# EAGLE design rgb-matrix-backpack-3-test (EAGLE 6.2)
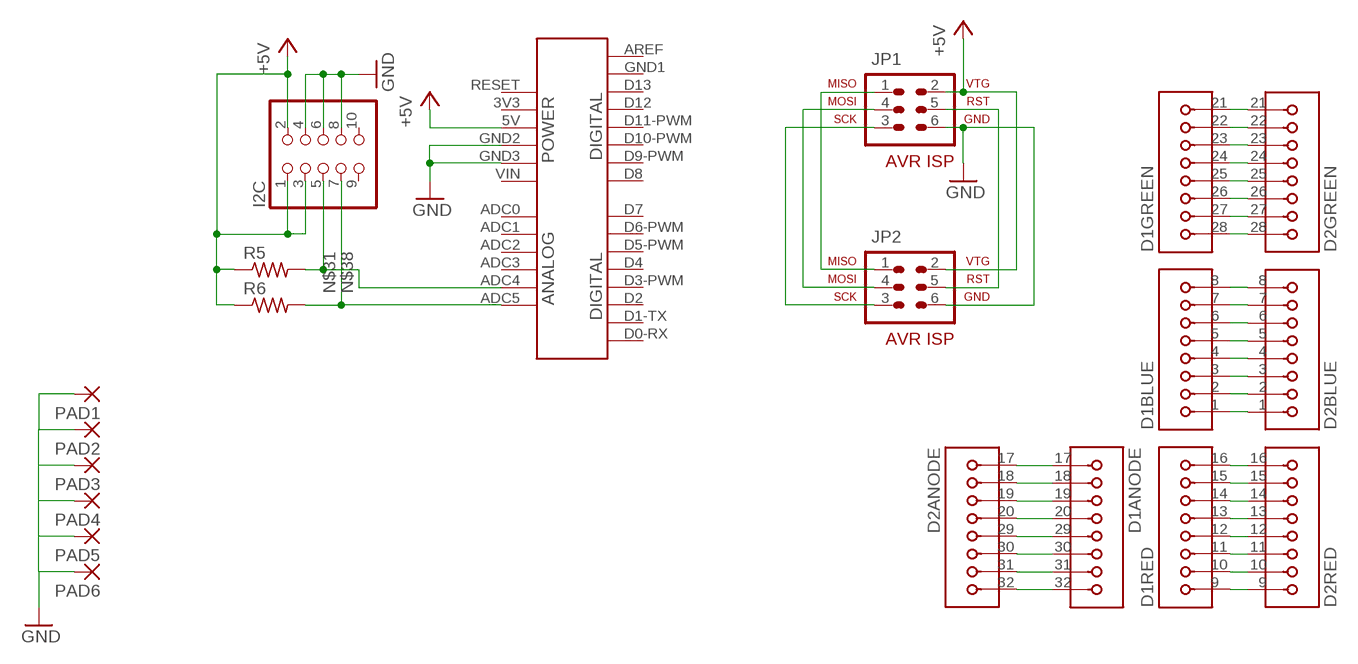
[diagram p0: schematic, sheet 1]

## Parts
D1  60MM-8X8-RGB-LED-ARRAY  [60MM-8X8-RGB-MATRIX]
D2  60MM-8X8-RGB-LED-ARRAY  [60MM-8X8-RGB-MATRIX]
I2C  PINHD-2X5_2.54-90°  [2X05/90]
JP1  AVR-ISP-6  [AVR-ISP-6]
JP2  AVR-ISP-6  [AVR-ISP-6]
PAD1  1,6/0,8  [1,6/0,8]
PAD2  1,6/0,8  [1,6/0,8]
PAD3  1,6/0,8  [1,6/0,8]
PAD4  1,6/0,8  [1,6/0,8]
PAD5  1,6/0,8  [1,6/0,8]
PAD6  1,6/0,8  [1,6/0,8]
R5  R-US_R0603  [R0603]
R6  R-US_R0603  [R0603]
SHIELD1  2009  [2009]

## Nets
+5V [power]: I2C.1 I2C.2 I2C.3 JP1.2 JP2.2 R5.1 R6.1 SHIELD1.5V
GND [power]: I2C.4 I2C.6 I2C.8 JP1.6 JP2.6 PAD1.1(P) PAD2.1(P) PAD3.1(P) PAD4.1(P) PAD5.1(P) PAD6.1(P) SHIELD1.GND2 SHIELD1.GND3
N$1: D1.17 D2.17
N$2: D1.18 D2.18
N$3: D1.19 D2.19
N$4: D1.20 D2.20
N$5: D1.29 D2.29
N$6: D1.30 D2.30
N$7: D1.31 D2.31
N$8: D1.32 D2.32
N$9: D1.1 D2.1
N$10: D1.2 D2.2
N$11: D1.3 D2.3
N$12: D1.4 D2.4
N$13: D1.5 D2.5
N$14: D1.6 D2.6
N$15: D1.7 D2.7
N$16: D1.8 D2.8
N$17: D1.9 D2.9
N$18: D1.10 D2.10
N$19: D1.11 D2.11
N$20: D1.12 D2.12
N$21: D1.13 D2.13
N$22: D1.14 D2.14
N$23: D1.15 D2.15
N$24: D1.16 D2.16
N$25: D1.28 D2.28
N$26: D1.27 D2.27
N$27: D1.26 D2.26
N$28: JP1.1 JP2.1
N$29: D1.25 D2.25
N$30: D1.24 D2.24
N$31: I2C.5 R5.2 SHIELD1.ADC4
N$32: D1.23 D2.23
N$33: D1.22 D2.22
N$36: D1.21 D2.21
N$37: JP1.5 JP2.5
N$38: I2C.7 R6.2 SHIELD1.ADC5
SCL: JP1.3 JP2.3
SDA: JP1.4 JP2.4
Unconnected: I2C.9 I2C.10 SHIELD1.3V3 SHIELD1.ADC0 SHIELD1.ADC1 SHIELD1.ADC2 SHIELD1.ADC3 SHIELD1.AREF SHIELD1.D0-RX(D0) SHIELD1.D1-TX(D1) SHIELD1.D2 SHIELD1.D3-PWM(D3) SHIELD1.D4 SHIELD1.D5-PWM(D5) SHIELD1.D6-PWM(D6) SHIELD1.D7 SHIELD1.D8 SHIELD1.D9-PWM(D9) SHIELD1.D10-PWM(D10) SHIELD1.D11-PWM(D11) SHIELD1.D12 SHIELD1.D13 SHIELD1.GND1 SHIELD1.RESET SHIELD1.VIN

## Library data of the parts
D1 D2 = logos-diodes:60MM-8X8-RGB-LED-ARRAY
I2C = pinhead-1:PINHD-2X5: PIN HEADER
JP1 JP2 = avr-4:AVR-ISP-6: AVR ISP-6 Serial Programming Header
PAD1-PAD6 = wirepad:1,6/0,8: THROUGH-HOLE PAD
R5 R6 = resistor:R-US_: RESISTOR, American symbol
SHIELD1 = arduino-shields:2009

## Net classes
1 power: width 0.406 mm, drill 0.381 mm
2 led: width 0.305 mm

## Board
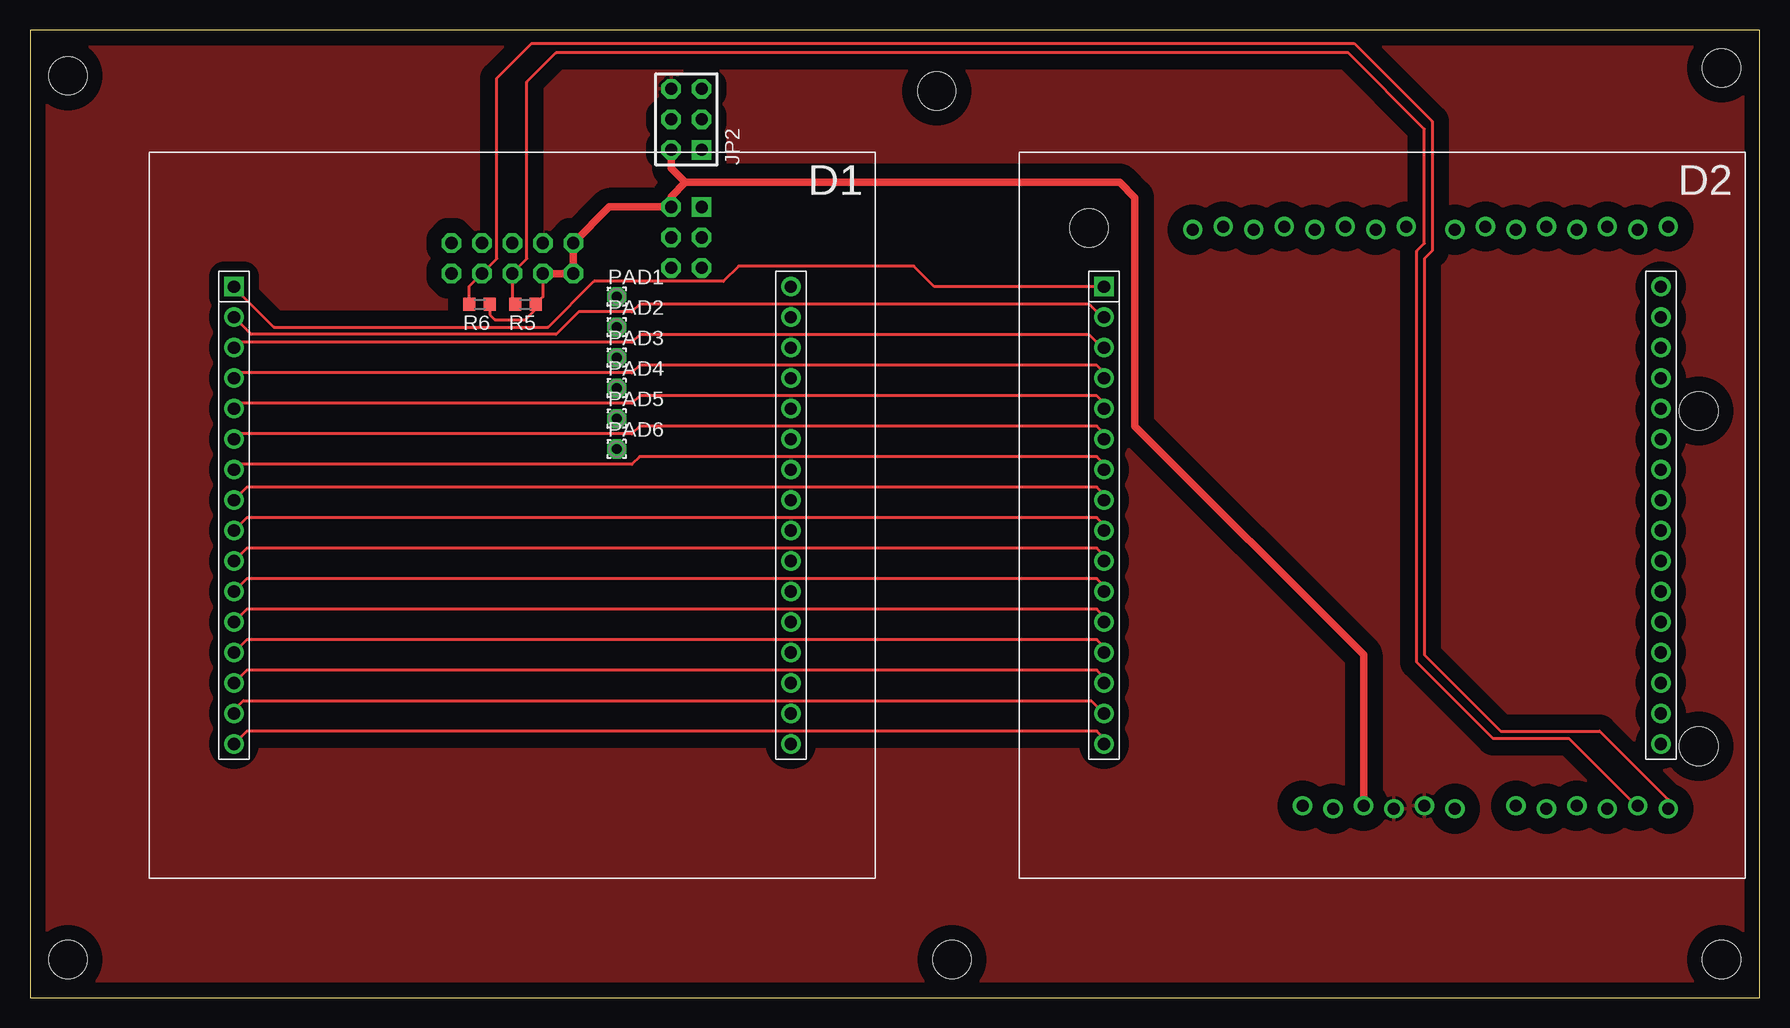
[diagram p1: board, top side]
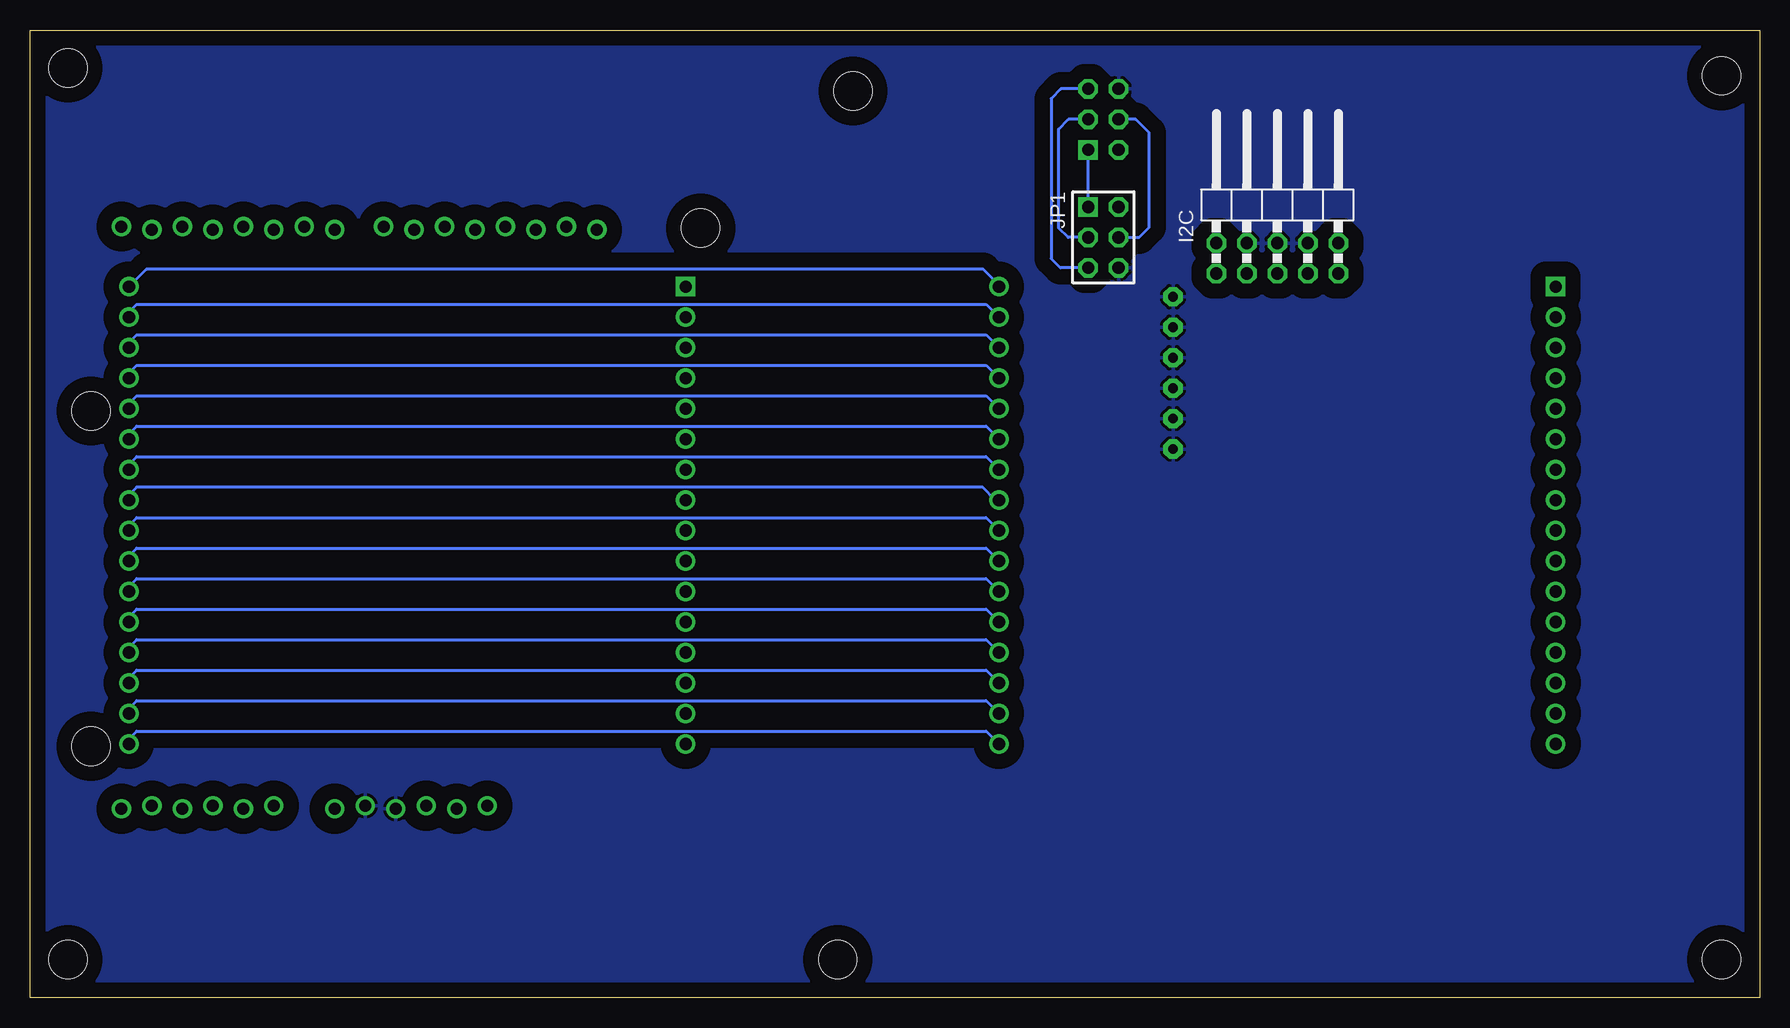
[diagram p2: board, bottom side, seen from below]

Size 144.14 x 80.64 mm. Coordinates in mm from the lower left corner, seen from the top.
Outline: 0,0 144.14,0 144.14,80.64 0,80.64 0,0
Copper layers (1*16): Top 0.035559375mm / dielectric 1.501140625mm / Bottom 0.035559375mm
Design rules: minimum track width 7mil, minimum drill 17mil, track to track 7mil, track to pad 7mil, pad to pad 7mil, via to via 7mil, smd to smd 0mil, copper to edge 10mil, drill to drill 8mil, minimum pad ring 12mil, minimum via ring 10mil, stop-mask expansion 0mil, vias tented up to drill 50mil, thermal gap 10mil
Holes 3.17 mm at 3.17,3.17 76.84,3.17 75.56,75.56 3.17,76.84 140.97,77.47 140.97,3.17

### Footprints (pad centres in the part's own frame; a part is rotated, then mirrored left to right if it is on the bottom)
60MM-8X8-RGB-MATRIX = drill 1.016 square: 1 -23.2,19.05 | drill 1.016: 2 -23.2,16.51; 3 -23.2,13.97; 4 -23.2,11.43; 5 -23.2,8.89; 6 -23.2,6.35; 7 -23.2,3.81; 8 -23.2,1.27; 9 -23.2,-1.27; 10 -23.2,-3.81; 11 -23.2,-6.35; 12 -23.2,-8.89; 13 -23.2,-11.43; 14 -23.2,-13.97; 15 -23.2,-16.51; 16 -23.2,-19.05; 17 23.2,-19.05; 18 23.2,-16.51; 19 23.2,-13.97; 20 23.2,-11.43; 21 23.2,-8.89; 22 23.2,-6.35; 23 23.2,-3.81; 24 23.2,-1.27; 25 23.2,1.27; 26 23.2,3.81; 27 23.2,6.35; 28 23.2,8.89; 29 23.2,11.43; 30 23.2,13.97; 31 23.2,16.51; 32 23.2,19.05
2X05/90 = drill 1.016 octagon: 1 -5.08,-6.35; 2 -5.08,-3.81; 3 -2.54,-6.35; 4 -2.54,-3.81; 5 0,-6.35; 6 0,-3.81; 7 2.54,-6.35; 8 2.54,-3.81; 9 5.08,-6.35; 10 5.08,-3.81
AVR-ISP-6 = drill 1.016 square: 1 -2.54,-1.27 | drill 1.016 octagon: 2 -2.54,1.27; 3 0,-1.27; 4 0,1.27; 5 2.54,-1.27; 6 2.54,1.27
1,6/0,8 = drill 0.813 pad 1.6 octagon: 1 0,0
R0603 = smd 1 x 1.1: 1 -0.85,0; 2 0.85,0
2009 = drill 1: 3V3 35.56,2.413; 5V 38.1,2.667; ADC0 50.8,2.667; ADC1 53.34,2.413; ADC2 55.88,2.667; ADC3 58.42,2.413; ADC4 60.96,2.667; ADC5 63.5,2.413; AREF 23.876,50.673; D0-RX 63.5,50.927; D1-TX 60.96,50.673; D2 58.42,50.927; D3-PWM 55.88,50.673; D4 53.34,50.927; D5-PWM 50.8,50.673; D6-PWM 48.26,50.927; D7 45.72,50.673; D8 41.656,50.927; D9-PWM 39.116,50.673; D10-PWM 36.576,50.927; D11-PWM 34.036,50.673; D12 31.496,50.927; D13 28.956,50.673; GND1 26.416,50.927; GND2 40.64,2.413; GND3 43.18,2.667; RESET 33.02,2.667; VIN 45.72,2.413 | hole 3.2: 15.24,50.8; 66.04,35.56; 66.04,7.62

### Placement (x,y rotation side)
D1  40.2,40.2 0 top
D2  112.7,40.2 0 top
I2C  40.2,66.7 0 bottom
JP1  54.7,63.36 270 bottom
JP2  54.7,73.2 90 top
PAD1  48.89,58.42 0 top
PAD2  48.89,55.88 0 top
PAD3  48.89,53.34 0 top
PAD4  48.89,50.8 0 top
PAD5  48.89,48.26 0 top
PAD6  48.89,45.72 0 top
R5  41.27,57.78 180 top
R6  37.47,57.78 180 top
SHIELD1  73.03,13.33 0 top

### Tracks (layer width: path | path; a pad name or v marks a point on that pad's centre or on a via)
+5V
  Top 0.254: R6.1 38.31,56.94 38.73,56.52 41.27,56.52 42.12,57.36 R5.1 42.74,58.4 I2C.3
  Top 0.61: I2C.3 I2C.1 I2C.2 48.29,65.9 JP1.2 53.43,66.77 54.61,67.94 | 54.61,67.94 90.81,67.94 92.08,66.67 92.08,47.62 111.12,28.57 SHIELD1.5V | JP2.2 53.43,69.12 54.61,67.94
GND
  pour Top (isolate 1.27): 0,80.64 144.14,80.64 144.14,0 0,0
  pour Bottom (isolate 1.27): 0,80.64 144.14,80.64 144.14,0 0,0
N$1
  Bottom 0.254: D2.17 135.9,21.58 135.25,22.23 64.47,22.23 D1.17
N$2
  Bottom 0.254: D2.18 135.9,24.12 135.25,24.77 64.47,24.77 D1.18
N$3
  Bottom 0.254: D2.19 135.9,26.66 135.25,27.3 64.47,27.3 D1.19
N$4
  Bottom 0.254: D2.20 135.9,29.2 135.25,29.84 64.47,29.84 D1.20
N$5
  Bottom 0.254: D2.29 135.9,52.06 135.25,52.7 64.47,52.7 D1.29
N$6
  Bottom 0.254: D2.30 135.9,54.6 135.25,55.25 64.47,55.25 D1.30
N$7
  Bottom 0.254: D2.31 135.9,57.14 135.25,57.78 64.47,57.78 D1.31
N$8
  Bottom 0.254: D1.32 63.4,59.4 64.7,60.7 134.45,60.7 D2.32
N$9
  Top 0.254: D2.1 75.37,59.25 73.66,60.96 59.05,60.96 57.78,59.69 46.99,59.69 43.18,55.88 20.32,55.88 17.2,59 17.2,59.05 D1.1
N$10
  Top 0.254: D2.2 89.34,56.71 88.27,57.78 50.8,57.78 50.17,57.15 45.72,57.15 43.85,55.28 18.43,55.28 D1.2
N$11
  Top 0.254: D2.3 89.34,54.17 88.27,55.25 50.8,55.25 50.17,54.61 17.44,54.61 D1.3
N$12
  Top 0.254: D2.4 89.5,52.11 88.9,52.7 50.8,52.7 50.17,52.07 17.44,52.07 D1.4
N$13
  Top 0.254: D2.5 89.5,49.56 88.9,50.17 50.8,50.17 50.17,49.53 17.44,49.53 D1.5
N$14
  Top 0.254: D2.6 89.5,47.03 88.9,47.62 50.8,47.62 50.17,46.99 17.44,46.99 D1.6
N$15
  Top 0.254: D2.7 89.5,44.48 88.9,45.08 50.8,45.08 50.17,44.45 17.44,44.45 D1.7
N$16
  Top 0.254: D2.8 89.5,41.95 88.9,42.55 18.07,42.55 D1.8
N$17
  Top 0.254: D2.9 89.5,39.41 88.9,40 18.07,40 D1.9
N$18
  Top 0.254: D2.10 89.5,36.86 88.9,37.47 18.07,37.47 D1.10
N$19
  Top 0.254: D2.11 89.5,34.33 88.9,34.92 18.07,34.92 D1.11
N$20
  Top 0.254: D2.12 89.5,31.79 88.9,32.38 18.07,32.38 D1.12
N$21
  Top 0.254: D2.13 89.5,29.25 88.9,29.84 18.07,29.84 D1.13
N$22
  Top 0.254: D2.14 89.5,26.7 88.9,27.3 18.07,27.3 D1.14
N$23
  Top 0.254: D1.15 17,23.98 17.78,24.77 88.42,24.77 D2.15
N$24
  Top 0.254: D2.16 89.5,21.62 88.9,22.23 18.07,22.23 D1.16
N$25
  Bottom 0.254: D2.28 135.9,49.52 135.25,50.17 64.47,50.17 D1.28
N$26
  Bottom 0.254: D2.27 135.9,46.98 135.25,47.62 64.47,47.62 D1.27
N$27
  Bottom 0.254: D2.26 135.9,44.44 135.25,45.08 64.47,45.08 D1.26
N$28
  Bottom 0.254: JP1.1 JP2.1
N$29
  Bottom 0.254: D1.25 63.69,41.47 64.77,42.55 135.25,42.55 135.9,41.9 D2.25
N$30
  Bottom 0.254: D2.24 135.9,39.36 135.25,40 64.47,40 D1.24
N$31
  Top 0.254: R5.2 40.2,58.01 I2C.5 40.2,60.4 41.4,61.6 41.4,76.33 43.81,78.74 109.86,78.74 116.2,72.39 116.2,62.86 115.57,62.23 115.57,27.94 121.92,21.59 128.27,21.59 133.86,16 SHIELD1.ADC4
N$32
  Bottom 0.254: D2.23 135.9,36.82 135.25,37.47 64.47,37.47 D1.23
N$33
  Bottom 0.254: D2.22 135.9,34.28 135.25,34.92 64.47,34.92 D1.22
N$36
  Bottom 0.254: D2.21 135.9,31.74 135.25,32.38 64.47,32.38 D1.21
N$37
  Bottom 0.254: JP1.5 58.28,60.82 59.05,61.59 59.05,74.93 58.25,75.74 JP2.5
N$38
  Top 0.254: R6.2 36.61,59.3 I2C.7 38.9,61.6 38.9,76.63 41.8,79.53 110.34,79.53 116.84,73.03 116.84,62.23 116.2,61.59 116.2,28.57 122.56,22.23 130.81,22.23 136.53,16.51 SHIELD1.ADC5
SCL
  Bottom 0.254: JP1.3 57.64,63.36 58.42,64.14 58.42,72.39 57.61,73.2 JP2.3
SDA
  Bottom 0.254: JP1.4 51.72,63.36 50.89,64.2 50.89,72.09 52,73.2 JP2.4